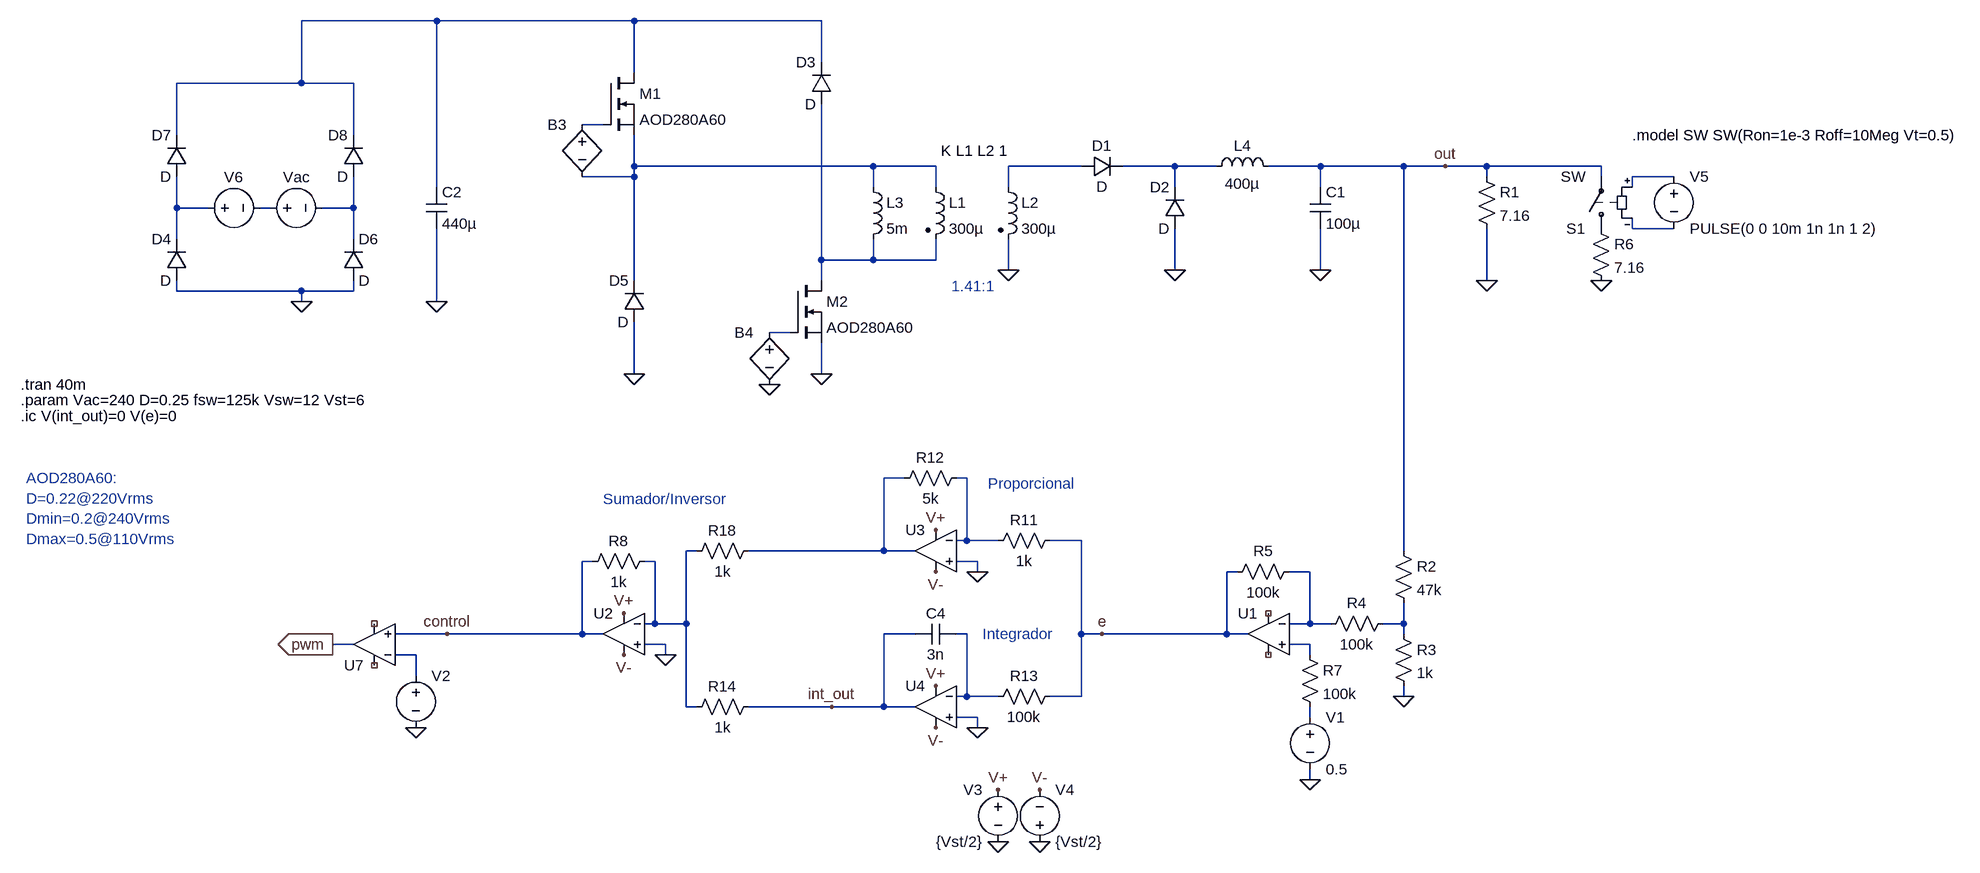
[diagram p0: schematic Forward-pwm.asc]
Forward-pwm.asc, the LTspice schematic file:
Version 4
SHEET 1 2088 1364
WIRE -384 -144 -592 -144
WIRE -80 -144 -384 -144
WIRE 208 -144 -80 -144
WIRE 208 -80 208 -144
WIRE -80 -64 -80 -144
WIRE -592 -48 -592 -144
WIRE -592 -48 -784 -48
WIRE -512 -48 -592 -48
WIRE -128 16 -160 16
WIRE -784 32 -784 -48
WIRE -512 32 -512 -48
WIRE -80 80 -80 32
WIRE 288 80 -80 80
WIRE 384 80 288 80
WIRE 608 80 496 80
WIRE 752 80 672 80
WIRE 816 80 752 80
WIRE 976 80 896 80
WIRE 1104 80 976 80
WIRE 1168 80 1104 80
WIRE 1232 80 1168 80
WIRE 1408 80 1232 80
WIRE -80 96 -80 80
WIRE -80 96 -160 96
WIRE 1232 96 1232 80
WIRE 1408 96 1408 80
WIRE 1520 96 1456 96
WIRE -384 112 -384 -144
WIRE 288 112 288 80
WIRE 384 112 384 80
WIRE 496 112 496 80
WIRE 752 112 752 80
WIRE 976 112 976 80
WIRE 1456 112 1456 96
WIRE -784 144 -784 96
WIRE -736 144 -784 144
WIRE -640 144 -656 144
WIRE -512 144 -512 96
WIRE -512 144 -560 144
WIRE 1456 176 1456 160
WIRE 1520 176 1456 176
WIRE -784 192 -784 144
WIRE -512 192 -512 144
WIRE 208 224 208 -16
WIRE 288 224 288 192
WIRE 288 224 208 224
WIRE 384 224 384 192
WIRE 384 224 288 224
WIRE 496 240 496 192
WIRE 752 240 752 176
WIRE 976 240 976 176
WIRE -80 256 -80 96
WIRE 208 256 208 224
WIRE 1232 256 1232 176
WIRE -784 272 -784 256
WIRE -592 272 -784 272
WIRE -512 272 -512 256
WIRE -512 272 -592 272
WIRE -592 288 -592 272
WIRE -384 288 -384 176
WIRE 160 336 128 336
WIRE -80 400 -80 320
WIRE 208 400 208 352
WIRE 336 560 304 560
WIRE 432 560 416 560
WIRE 432 656 432 560
WIRE 432 656 416 656
WIRE 480 656 432 656
WIRE 608 656 560 656
WIRE 16 672 0 672
WIRE 304 672 304 560
WIRE 304 672 96 672
WIRE 352 672 304 672
WIRE 1104 672 1104 80
WIRE -144 688 -160 688
WIRE -48 688 -64 688
WIRE 448 688 416 688
WIRE 448 704 448 688
WIRE 848 704 832 704
WIRE 960 704 928 704
WIRE -48 784 -48 688
WIRE -48 784 -64 784
WIRE 0 784 0 672
WIRE 0 784 -48 784
WIRE 960 784 960 704
WIRE 960 784 928 784
WIRE 992 784 960 784
WIRE 1104 784 1104 752
WIRE 1104 784 1072 784
WIRE -368 800 -448 800
WIRE -160 800 -160 688
WIRE -160 800 -368 800
WIRE -128 800 -160 800
WIRE 352 800 304 800
WIRE 432 800 416 800
WIRE 608 800 608 656
WIRE 640 800 608 800
WIRE 832 800 832 704
WIRE 832 800 640 800
WIRE 864 800 832 800
WIRE 1104 800 1104 784
WIRE -512 816 -544 816
WIRE -32 816 -64 816
WIRE 960 816 928 816
WIRE -416 832 -448 832
WIRE -32 832 -32 816
WIRE 960 832 960 816
WIRE -416 864 -416 832
WIRE 432 896 432 800
WIRE 432 896 416 896
WIRE 480 896 432 896
WIRE 608 896 608 800
WIRE 608 896 560 896
WIRE 1104 896 1104 880
WIRE 0 912 0 784
WIRE 16 912 0 912
WIRE 224 912 96 912
WIRE 304 912 304 800
WIRE 304 912 224 912
WIRE 352 912 304 912
WIRE 448 928 416 928
WIRE 960 928 960 912
WIRE 448 944 448 928
WIRE 960 1024 960 1008
FLAG 496 240 0
FLAG 752 240 0
FLAG 976 240 0
FLAG 1232 256 0
FLAG 208 400 0
FLAG -80 400 0
FLAG -592 288 0
FLAG -384 288 0
FLAG 1104 896 0
FLAG 960 1024 0
FLAG -416 944 0
FLAG -544 816 pwm
IOPIN -544 816 Out
FLAG 640 800 e
FLAG -32 832 0
FLAG 448 704 0
FLAG 448 944 0
FLAG 224 912 int_out
FLAG 1168 80 out
FLAG -368 800 control
FLAG 128 416 0
FLAG 480 1120 0
FLAG 544 1120 0
FLAG 480 1040 V+
FLAG 384 880 V+
FLAG 384 640 V+
FLAG 384 944 V-
FLAG 384 704 V-
FLAG 544 1040 V-
FLAG -96 768 V+
FLAG -96 832 V-
FLAG 1408 256 0
SYMBOL ind2 368 96 R0
SYMATTR InstName L1
SYMATTR Value 300µ
SYMATTR Type ind
SYMBOL ind2 480 96 R0
SYMATTR InstName L2
SYMATTR Value 300µ
SYMATTR Type ind
SYMBOL ind 800 96 R270
WINDOW 0 32 56 VTop 2
WINDOW 3 5 56 VBottom 2
SYMATTR InstName L4
SYMATTR Value 400µ
SYMATTR SpiceLine Rser=20m
SYMBOL cap 960 112 R0
SYMATTR InstName C1
SYMATTR Value 100µ
SYMATTR SpiceLine Rser=10m
SYMBOL res 1216 80 R0
SYMATTR InstName R1
SYMATTR Value 7.16
SYMBOL nmos 160 256 R0
SYMATTR InstName M2
SYMATTR Value AOD280A60
SYMBOL diode -64 320 R180
WINDOW 0 24 64 Left 2
WINDOW 3 24 0 Left 2
SYMATTR InstName D5
SYMBOL diode 224 -16 R180
WINDOW 0 24 64 Left 2
WINDOW 3 24 0 Left 2
SYMATTR InstName D3
SYMBOL diode 608 96 R270
WINDOW 0 32 32 VTop 2
WINDOW 3 0 32 VBottom 2
SYMATTR InstName D1
SYMBOL diode 768 176 R180
WINDOW 0 24 64 Left 2
WINDOW 3 24 0 Left 2
SYMATTR InstName D2
SYMBOL nmos -128 -64 R0
SYMATTR InstName M1
SYMATTR Value AOD280A60
SYMBOL ind 272 96 R0
SYMATTR InstName L3
SYMATTR Value 5m
SYMBOL voltage -656 144 R270
WINDOW 0 32 56 VTop 2
WINDOW 3 -32 56 Invisible 2
WINDOW 123 0 0 Left 0
WINDOW 39 0 0 Left 0
SYMATTR InstName Vac
SYMATTR Value SINE(0 {Vac*sqrt(2)} 50)
SYMBOL cap -400 112 R0
SYMATTR InstName C2
SYMATTR Value 440µ
SYMBOL diode -768 256 R180
WINDOW 0 24 64 Left 2
WINDOW 3 24 0 Left 2
SYMATTR InstName D4
SYMBOL diode -528 256 M180
WINDOW 0 24 64 Left 2
WINDOW 3 24 0 Left 2
SYMATTR InstName D6
SYMBOL diode -768 96 R180
WINDOW 0 24 64 Left 2
WINDOW 3 24 0 Left 2
SYMATTR InstName D7
SYMBOL diode -496 96 R180
WINDOW 0 24 64 Left 2
WINDOW 3 24 0 Left 2
SYMATTR InstName D8
SYMBOL res 1088 656 R0
SYMATTR InstName R2
SYMATTR Value 47k
SYMBOL res 1088 784 R0
SYMATTR InstName R3
SYMATTR Value 1k
SYMBOL OpAmps\\UniversalOpAmp1 896 800 M0
SYMATTR InstName U1
SYMBOL res 1088 768 R90
WINDOW 0 0 56 VBottom 2
WINDOW 3 32 56 VTop 2
SYMATTR InstName R4
SYMATTR Value 100k
SYMBOL voltage 960 912 R0
WINDOW 123 0 0 Left 0
WINDOW 39 0 0 Left 0
SYMATTR InstName V1
SYMATTR Value 0.5
SYMBOL res 944 816 R0
SYMATTR InstName R7
SYMATTR Value 100k
SYMBOL res 944 688 R90
WINDOW 0 0 56 VBottom 2
WINDOW 3 32 56 VTop 2
SYMATTR InstName R5
SYMATTR Value 100k
SYMBOL OpAmps\\UniversalOpAmp2 -480 816 R180
SYMATTR InstName U7
SYMATTR Value2 Avol=1Meg GBW=100G Slew=100G
SYMBOL voltage -416 848 R0
WINDOW 3 24 96 Invisible 2
WINDOW 123 0 0 Left 0
WINDOW 39 0 0 Left 0
SYMATTR Value PULSE(0 {Vst} 0 {0.99/fsw} {0.01/fsw} 0 {1/fsw})
SYMATTR InstName V2
SYMBOL res -48 672 R90
WINDOW 0 0 56 VBottom 2
WINDOW 3 32 56 VTop 2
SYMATTR InstName R8
SYMATTR Value 1k
SYMBOL res 576 640 R90
WINDOW 0 0 56 VBottom 2
WINDOW 3 32 56 VTop 2
SYMATTR InstName R11
SYMATTR Value 1k
SYMBOL res 432 544 R90
WINDOW 0 0 56 VBottom 2
WINDOW 3 32 56 VTop 2
SYMATTR InstName R12
SYMATTR Value 5k
SYMBOL res 576 880 R90
WINDOW 0 0 56 VBottom 2
WINDOW 3 32 56 VTop 2
SYMATTR InstName R13
SYMATTR Value 100k
SYMBOL cap 416 784 R90
WINDOW 0 0 32 VBottom 2
WINDOW 3 32 32 VTop 2
SYMATTR InstName C4
SYMATTR Value 3n
SYMBOL res 112 896 R90
WINDOW 0 0 56 VBottom 2
WINDOW 3 32 56 VTop 2
SYMATTR InstName R14
SYMATTR Value 1k
SYMBOL res 112 656 R90
WINDOW 0 0 56 VBottom 2
WINDOW 3 32 56 VTop 2
SYMATTR InstName R18
SYMATTR Value 1k
SYMBOL bv -160 0 M0
WINDOW 3 24 96 Invisible 2
SYMATTR Value V=if(V(pwm)>0,12,0)
SYMATTR InstName B3
SYMBOL bv 128 320 M0
WINDOW 3 24 96 Invisible 2
SYMATTR Value V=if(V(pwm)>0,12,0)
SYMATTR InstName B4
SYMBOL OpAmps\\UniversalOpAmp2 384 672 M0
SYMATTR InstName U3
SYMBOL OpAmps\\UniversalOpAmp2 384 912 M0
SYMATTR InstName U4
SYMBOL voltage 480 1024 M0
WINDOW 123 0 0 Left 0
WINDOW 39 0 0 Left 0
SYMATTR InstName V3
SYMATTR Value {Vst/2}
SYMBOL voltage 544 1136 M180
WINDOW 0 24 96 Left 2
WINDOW 3 24 16 Left 2
WINDOW 123 0 0 Left 0
WINDOW 39 0 0 Left 0
SYMATTR InstName V4
SYMATTR Value {Vst/2}
SYMBOL OpAmps\\UniversalOpAmp2 -96 800 M0
SYMATTR InstName U2
SYMBOL sw 1408 192 R180
SYMATTR InstName S1
SYMBOL res 1392 160 R0
SYMATTR InstName R6
SYMATTR Value 7.16
SYMBOL voltage 1520 80 R0
WINDOW 123 0 0 Left 0
WINDOW 39 0 0 Left 0
SYMATTR InstName V5
SYMATTR Value PULSE(0 0 10m 1n 1n 1 2)
SYMBOL voltage -752 144 R270
WINDOW 0 32 56 VTop 2
WINDOW 3 -32 56 Invisible 2
WINDOW 123 0 0 Left 0
WINDOW 39 0 0 Left 0
SYMATTR InstName V6
SYMATTR Value PULSE(0 20 5m 1n 1n 5m 20m)
TEXT 392 56 Left 2 !K L1 L2 1
TEXT -1024 416 Left 2 !.tran 40m
TEXT -1024 440 Left 2 !.param Vac=240 D=0.25 fsw=125k Vsw=12 Vst=6
TEXT -1016 560 Left 2 ;AOD280A60:\nD=0.22@220Vrms\nDmin=0.2@240Vrms\nDmax=0.5@110Vrms
TEXT 408 264 Left 2 ;1.41:1
TEXT -128 592 Left 2 ;Sumador/Inversor
TEXT 464 568 Left 2 ;Proporcional
TEXT 456 800 Left 2 ;Integrador
TEXT -1024 464 Left 2 !.ic V(int_out)=0 V(e)=0
TEXT 1456 32 Left 2 !.model SW SW(Ron=1e-3 Roff=10Meg Vt=0.5)

The netlist it stands for:
* Forward-pwm.asc
L1 N003 N011 300µ
L2 N004 0 300µ
L4 N005 out 400µ Rser=20m
C1 out 0 100µ Rser=10m
R1 out 0 7.16
M2 N011 N012 0 0 AOD280A60
D5 0 N003 D
D3 N011 N001 D
D1 N004 N005 D
D2 0 N005 D
M1 N001 N002 N003 N003 AOD280A60
L3 N003 N011 5m
Vac N008 N009 SINE(0 {Vac*sqrt(2)} 50)
C2 N001 0 440µ
D4 0 N007 D
D6 0 N009 D
D7 N007 N001 D
D8 N009 N001 D
R2 out N017 47k
R3 N017 0 1k
XU1 N019 N016 NC_01 NC_02 e level1 Avol=1Meg GBW=10Meg Vos=0 En=0 Enk=0 In=0 Ink=0 Rin=500Meg  ; pins In+ In- V+ V- OUT
R4 N017 N016 100k
V1 N021 0 0.5
R7 N019 N021 100k
R5 N016 e 100k
XU7 control N020 NC_03 NC_04 pwm level2 Avol=1Meg GBW=100G Slew=100G Ilimit=25m Rail=0 Vos=0 En=0 Enk=0 In=0 Ink=0 Rin=500Meg  ; pins In+ In- V+ V- OUT
V2 N020 0 PULSE(0 {Vst} 0 {0.99/fsw} {0.01/fsw} 0 {1/fsw})
R8 N015 control 1k
R11 e N014 1k
R12 N014 N013 5k
R13 e N018 100k
C4 N018 int_out 3n
R14 int_out N015 1k
R18 N013 N015 1k
B3 N002 N003 V=if(V(pwm)>0,12,0)
B4 N012 0 V=if(V(pwm)>0,12,0)
XU3 0 N014 V+ V- N013 level2 Avol=1Meg GBW=10Meg Slew=10Meg Ilimit=25m Rail=0 Vos=0 En=0 Enk=0 In=0 Ink=0 Rin=500Meg  ; pins In+ In- V+ V- OUT
XU4 0 N018 V+ V- int_out level2 Avol=1Meg GBW=10Meg Slew=10Meg Ilimit=25m Rail=0 Vos=0 En=0 Enk=0 In=0 Ink=0 Rin=500Meg  ; pins In+ In- V+ V- OUT
V3 V+ 0 {Vst/2}
V4 0 V- {Vst/2}
XU2 0 N015 V+ V- control level2 Avol=1Meg GBW=10Meg Slew=10Meg Ilimit=25m Rail=0 Vos=0 En=0 Enk=0 In=0 Ink=0 Rin=500Meg  ; pins In+ In- V+ V- OUT
S1 P001 out N006 N010 SW
R6 P001 0 7.16
V5 N006 N010 PULSE(0 0 10m 1n 1n 1 2)
V6 N007 N008 PULSE(0 20 5m 1n 1n 5m 20m)
.model D D
.lib standard.dio
.model NMOS NMOS
.model PMOS PMOS
.lib standard.mos
K L1 L2 1
.tran 40m
.param Vac=240 D=0.25 fsw=125k Vsw=12 Vst=6
* AOD280A60:
* D=0.22@220Vrms
* Dmin=0.2@240Vrms
* Dmax=0.5@110Vrms
* 1.41:1
* Sumador/Inversor
* Proporcional
* Integrador
.ic V(int_out)=0 V(e)=0
.model SW SW(Ron=1e-3 Roff=10Meg Vt=0.5)
.lib UniversalOpAmp1.lib
.lib UniversalOpAmp2.lib
.backanno
.end